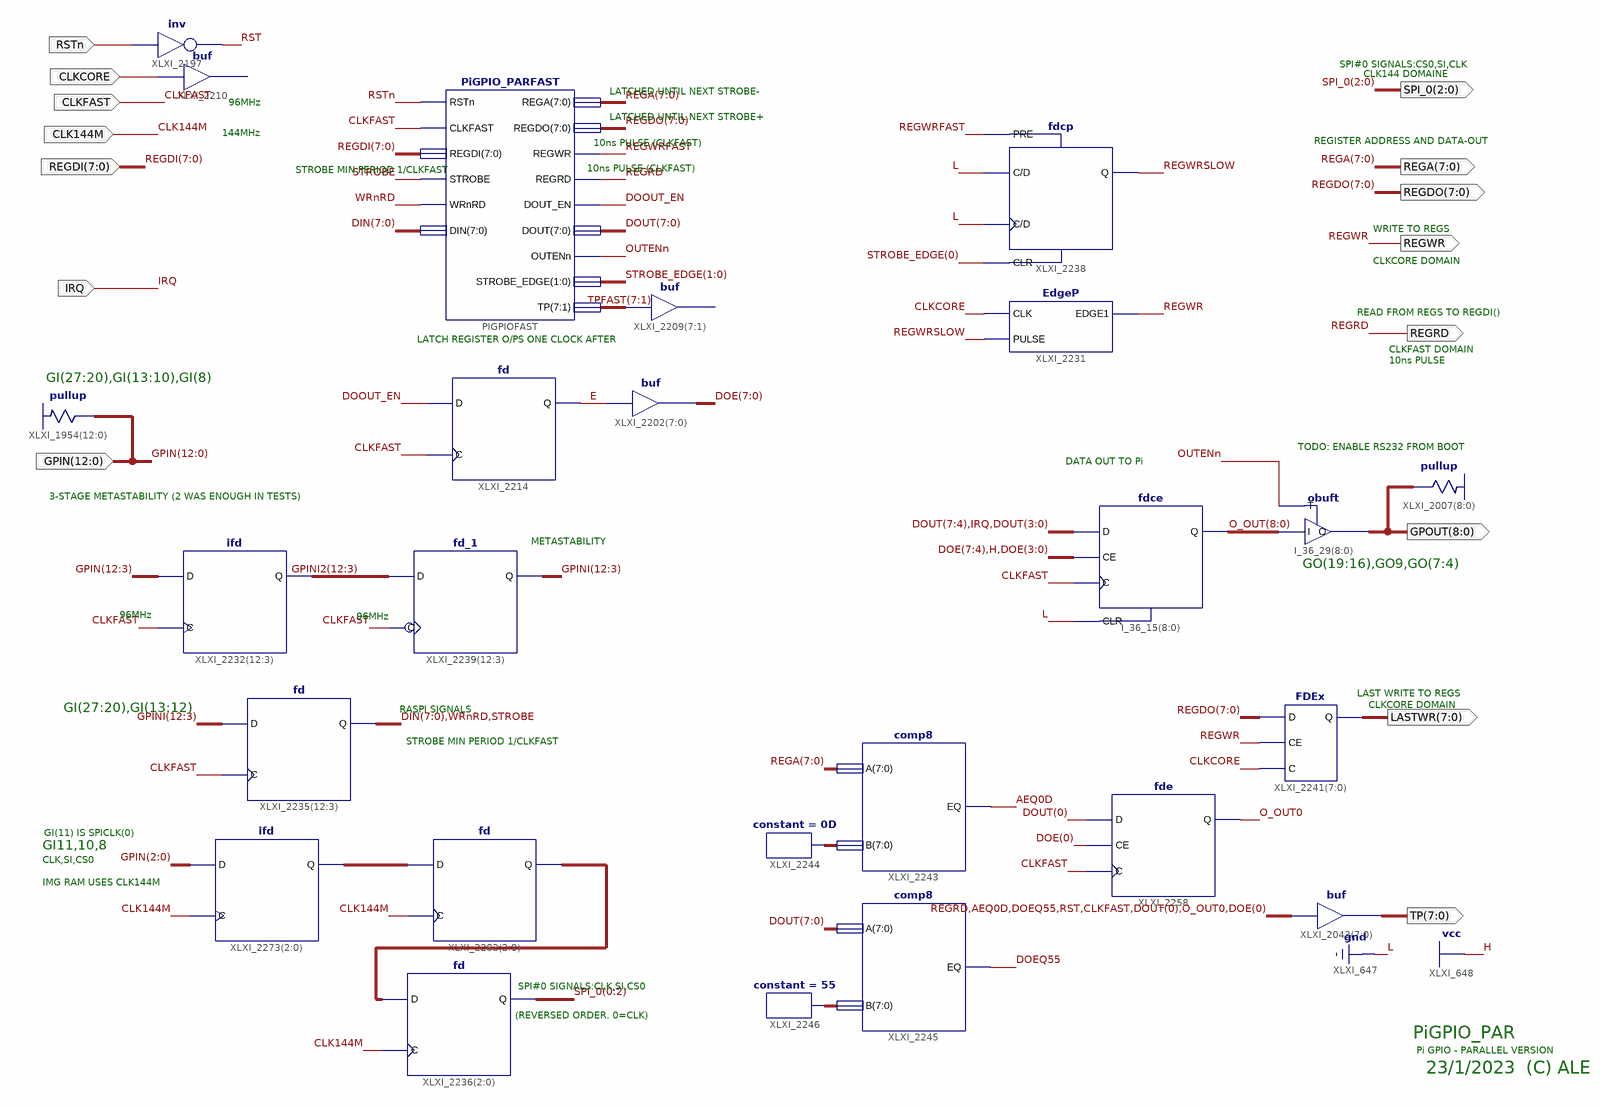
[diagram p0: schematic sheet 1]
// Xilinx ISE schematic PiGPIO_PAR.sch (spartan6) as structural Verilog: 25 symbols, 15 ports
module PiGPIO_PAR (
  input  CLKCORE,
  input  [7:0] REGDI,
  input  IRQ,
  input  CLKFAST,
  input  RSTn,
  input  CLK144M,
  input  [12:0] GPIN,
  output [7:0] REGA,
  output [7:0] REGDO,
  output REGWR,
  output REGRD,
  output [2:0] SPI_0,
  output [8:0] GPOUT,
  output [7:0] LASTWR,
  output [7:0] TP
);

  wire AEQ0D, DOEQ55, DOOUT_EN, E, O_OUT0, OUTENn, REGWRFAST, REGWRSLOW, RST, STROBE, WRnRD;
  wire [1:0] STROBE_EDGE;
  wire [2:0] XLXN_66, XLXN_67;
  wire [7:0] DIN, DOE, DOUT, XLXN_2, XLXN_5;
  wire [7:1] TPFAST;
  wire [8:0] O_OUT;
  wire [12:3] GPINI, GPINI2;

  not XLXI_2197 (RST, RSTn);
  // buf XLXI_2210 has open pins: I=CLKCORE, O=open
  fd XLXI_2214 (.C(CLKFAST), .D(DOOUT_EN), .Q(E));
  assign DOE = {8{E}};  // buf XLXI_2202[7..0], 8 bits wide
  // buf XLXI_2209[7..1] has open pins: I=TPFAST, O=open
  PiGPIO_PARFAST PIGPIOFAST (
    .CLKFAST(CLKFAST), .DIN(DIN), .DOUT(DOUT), .DOUT_EN(DOOUT_EN), .OUTENn(OUTENn), .REGA(REGA),
    .REGDI(REGDI), .REGDO(REGDO), .REGRD(REGRD), .REGWR(REGWRFAST), .RSTn(RSTn), .STROBE(STROBE),
    .STROBE_EDGE(STROBE_EDGE), .TP(TPFAST), .WRnRD(WRnRD));
  fdcp XLXI_2238 (.C(1'b0), .CLR(STROBE_EDGE[0]), .D(1'b0), .PRE(REGWRFAST), .Q(REGWRSLOW));
  EdgeP XLXI_2231 (.CLK(CLKCORE), .EDGE1(REGWR), .PULSE(REGWRSLOW));
  FDEx XLXI_2241[7:0] (.C(CLKCORE), .CE(REGWR), .D(REGDO), .Q(LASTWR));
  assign TP = {REGRD, AEQ0D, DOEQ55, RST, CLKFAST, DOUT[0], O_OUT0, DOE[0]};  // buf XLXI_2043[7..0], 8 bits wide
  comp8 XLXI_2243 (.A(REGA), .B(XLXN_2), .EQ(AEQ0D));
  constant #(.CValue("0D")) XLXI_2244 (.O(XLXN_2));
  comp8 XLXI_2245 (.A(DOUT), .B(XLXN_5), .EQ(DOEQ55));
  constant #(.CValue("55")) XLXI_2246 (.O(XLXN_5));
  obuft I_36_29[8:0] (.I(O_OUT), .T(OUTENn), .O(GPOUT));
  \pullup  XLXI_2007[8:0] (.O(GPOUT));
  fde XLXI_2258 (.C(CLKFAST), .CE(DOE[0]), .D(DOUT[0]), .Q(O_OUT0));
  fdce #(.IOB("TRUE")) I_36_15[8:0] (
    .C(CLKFAST), .CE({DOE[7:4], 1'b1, DOE[3:0]}), .CLR(1'b0), .D({DOUT[7:4], IRQ, DOUT[3:0]}), .Q(O_OUT));
  \pullup  XLXI_1954[12:0] (.O(GPIN));
  fd_1 XLXI_2239[12:3] (.C(CLKFAST), .D(GPINI2), .Q(GPINI));
  ifd XLXI_2232[12:3] (.C(CLKFAST), .D(GPIN[12:3]), .Q(GPINI2));
  fd XLXI_2235[12:3] (.C(CLKFAST), .D(GPINI), .Q({DIN, WRnRD, STROBE}));
  fd XLXI_2236[2:0] (.C(CLK144M), .D(XLXN_67), .Q({SPI_0[0], SPI_0[1], SPI_0[2]}));
  ifd XLXI_2273[2:0] (.C(CLK144M), .D(GPIN[2:0]), .Q(XLXN_66));
  fd XLXI_2283[2:0] (.C(CLK144M), .D(XLXN_66), .Q(XLXN_67));

  // Notes on the sheet:
  //   SPI#0 SIGNALS:CS0,SI,CLK
  //   CLK144 DOMAINE
  //   LATCHED UNTIL NEXT STROBE-
  //   96MHz
  //   LATCHED UNTIL NEXT STROBE+
  //   144MHz
  //   REGISTER ADDRESS AND DATA-OUT
  //   10ns PULSE (CLKFAST)
  //   10ns PULSE (CLKFAST)
  //   STROBE MIN PERIOD 1/CLKFAST
  //   WRITE TO REGS
  //   CLKCORE DOMAIN
  //   READ FROM REGS TO REGDI()
  //   LATCH REGISTER O/PS ONE CLOCK AFTER
  //   CLKFAST DOMAIN
  //   10ns PULSE
  //   GI(27:20),GI(13:10),GI(8)
  //   TODO: ENABLE RS232 FROM BOOT
  //   DATA OUT TO Pi
  //   3-STAGE METASTABILITY (2 WAS ENOUGH IN TESTS)
  //   METASTABILITY
  //   GO(19:16),GO9,GO(7:4)
  //   96MHz
  //   96MHz
  //   LAST WRITE TO REGS
  //   CLKCORE DOMAIN
  //   GI(27:20),GI(13:12)
  //   RASPI SIGNALS
  //   STROBE MIN PERIOD 1/CLKFAST
  //   GI(11) IS SPICLK(0)
  //   GI11,10,8
  //   CLK,SI,CS0
  //   IMG RAM USES CLK144M
  //   SPI#0 SIGNALS:CLK,SI,CS0
  //   (REVERSED ORDER. 0=CLK)
  //   PiGPIO_PAR
  //   Pi GPIO - PARALLEL VERSION
  //   23/1/2023  (C) ALE
endmodule
